# Altium schematic sheet 02_REVISIONS.SchDoc: Revisions
size B; DocumentNumber: 3; SheetNumber: 3; SheetTotal: 12
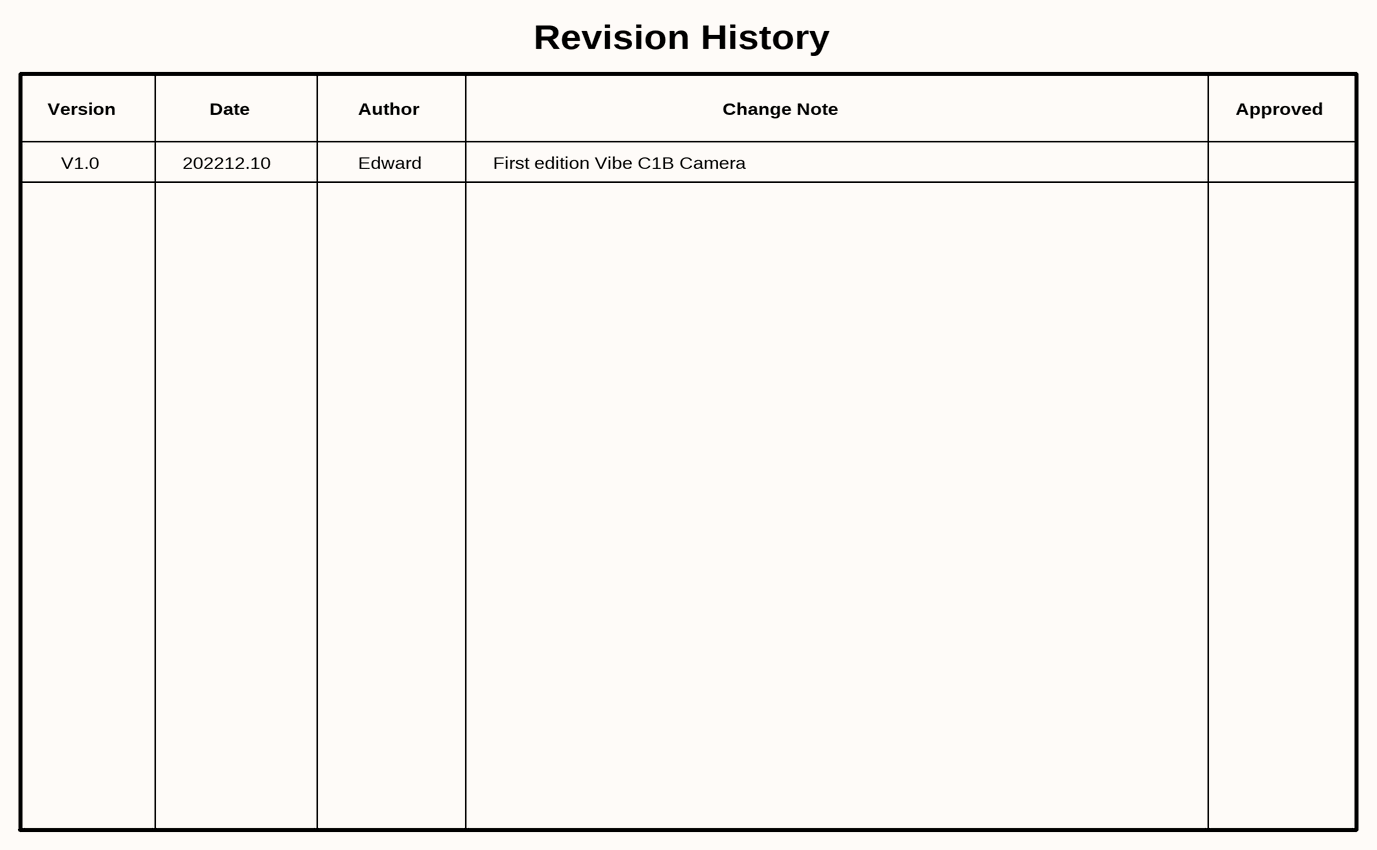
[diagram p0: 02_REVISIONS.SchDoc]

## Notes on the sheet
- Revision History
- Version
- Date
- Author
- Change Note
- Approved
- V1.0
- 202212.10
- Edward
- First edition Vibe C1B Camera
- Title
- Size:
- Date:
- B
- Number:
- Time:
- Revision:
- Sheet
- of
- Author: Edward Lai
- Email: edward@vibe.us
- Vibe Inc
- Hangzhou
- vibe.us <http://vibe.us>
- File: